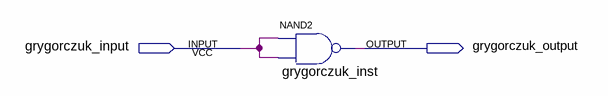
[diagram p0: schematic sheet]
// Quartus schematic NOT_GATES.bdf as structural Verilog: 1 symbols, 2 pins
module NOT_GATES (
  input  grygorczuk_input,
  output grygorczuk_output
);

  nand grygorczuk_inst (grygorczuk_output, grygorczuk_input, grygorczuk_input);
endmodule
